# EAGLE design esp32-controller (EAGLE 9.6.2)
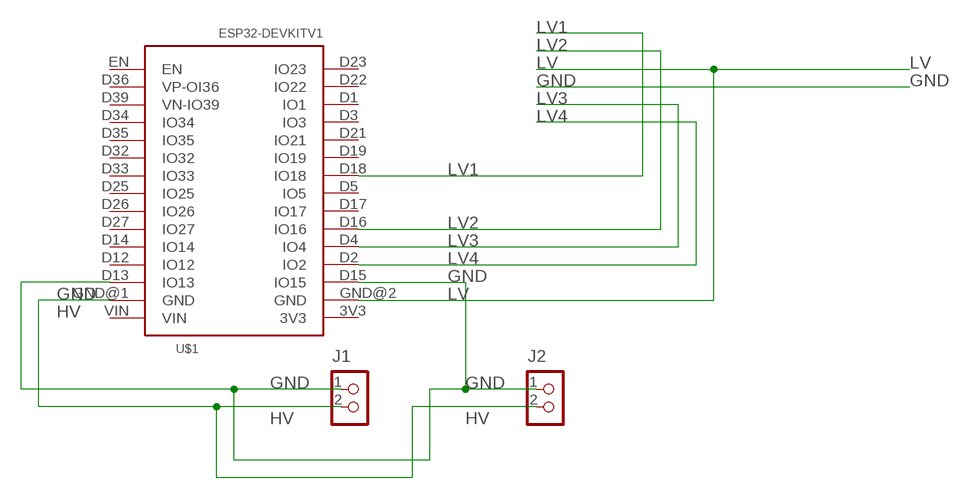
[diagram p0: schematic, sheet 1]

## Parts
J1  CON_TERMINAL_BLOCK_02-5MM  [TERMINAL_BLOCK_2P_5]
J2  CON_TERMINAL_BLOCK_02-5MM  [TERMINAL_BLOCK_2P_5]
U$1  ESP32DEVKITV1  [ESP32-DEVKITV1]

## Nets
GND: J1.1 J2.1 U$1.D13(IO13) U$1.D15(IO15)
HV: J1.2 J2.2 U$1.GND@1(GND)
LV: U$1.GND@2(GND)
LV1: U$1.D18(IO18)
LV2: U$1.D16(IO16)
LV3: U$1.D4(IO4)
LV4: U$1.D2(IO2)
Unconnected: U$1.3V3 U$1.D1(IO1) U$1.D3(IO3) U$1.D5(IO5) U$1.D12(IO12) U$1.D14(IO14) U$1.D17(IO17) U$1.D19(IO19) U$1.D21(IO21) U$1.D22(IO22) U$1.D23(IO23) U$1.D25(IO25) U$1.D26(IO26) U$1.D27(IO27) U$1.D32(IO32) U$1.D33(IO33) U$1.D34(IO34) U$1.D35(IO35) U$1.D36(VP-OI36) U$1.D39(VN-IO39) U$1.EN U$1.VIN

## Library data of the parts
J1 J2 = tblok:CON_TERMINAL_BLOCK_02: 2 poles wire to board terminal block
U$1 = esp32-devkit:ESP32DEVKITV1

## Board
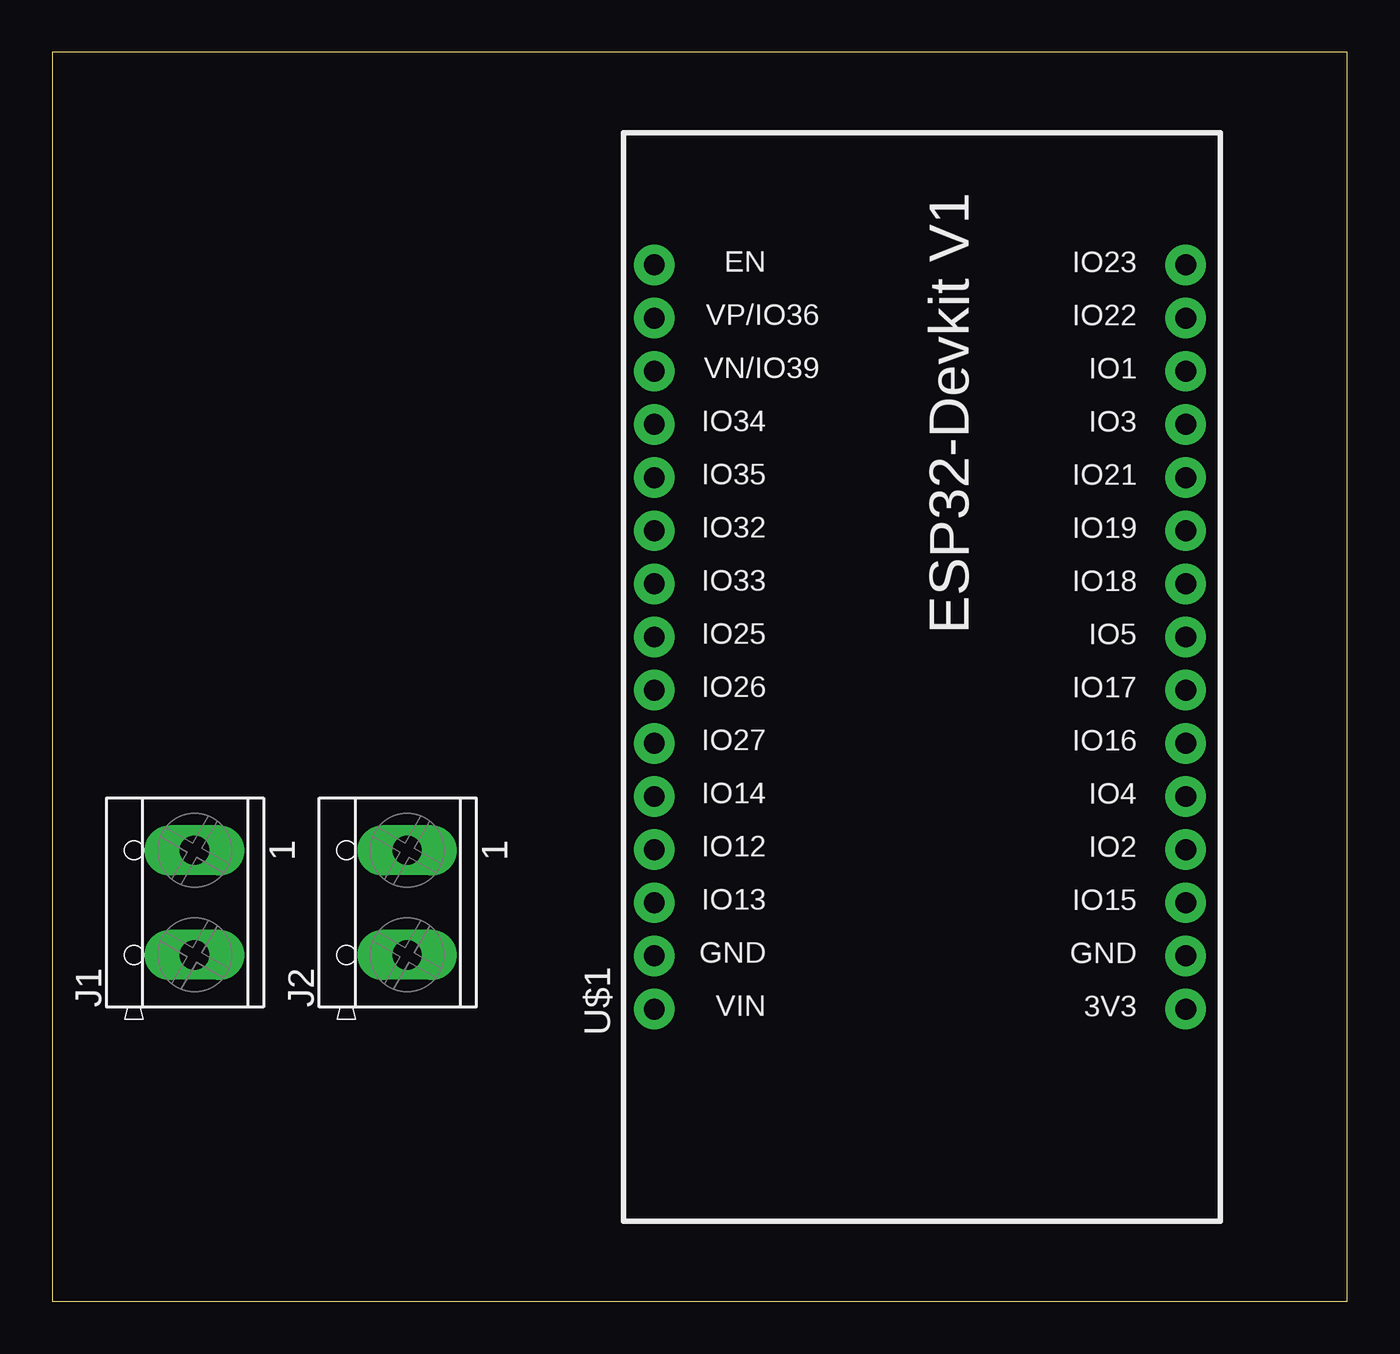
[diagram p1: board, top side]
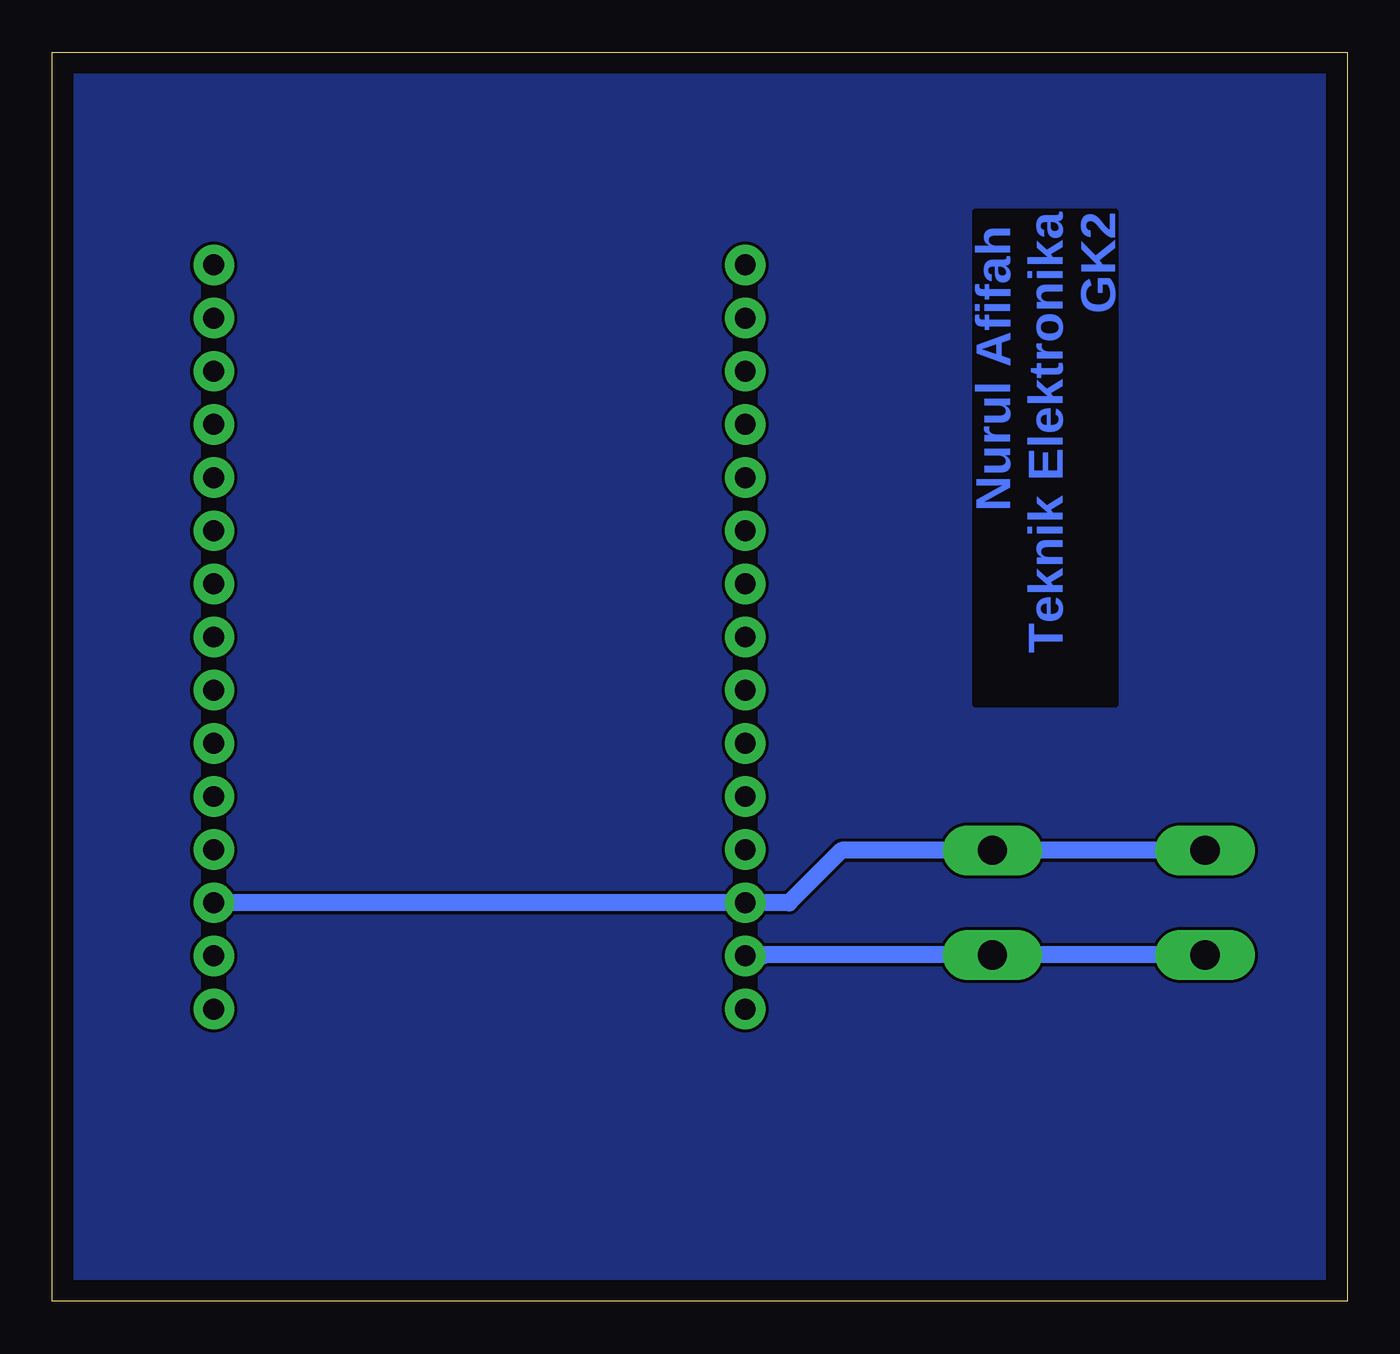
[diagram p2: board, bottom side, seen from below]

Size 61.9 x 59.68 mm. Coordinates in mm from the lower left corner, seen from the top.
Outline: 0,0 61.9,0 61.9,59.68 0,59.68 0,0
Copper layers (1*16): Top 0.035mm / dielectric 1.5mm / Bottom 0.035mm
Design rules "default": minimum track width 6mil, minimum drill 0.35mm, track to track 6mil, track to pad 6mil, pad to pad 6mil, via to via 6mil, smd to smd 6mil, copper to edge 40mil, drill to drill 6mil, minimum pad ring 10mil, minimum via ring 8mil, stop-mask expansion 4mil, vias tented up to drill 0mil, thermal gap 10mil

### Footprints (pad centres in the part's own frame; a part is rotated, then mirrored left to right if it is on the bottom)
TERMINAL_BLOCK_2P_5 = drill 1.4 pad 2.38 long: 1 2.5,-0.45; 2 -2.5,-0.45
ESP32-DEVKITV1 = drill 1 pad 1.93: 3V3 -16.52,-12.27; D1 13.96,-12.27; D2 -8.9,-12.27; D3 11.42,-12.27; D4 -6.36,-12.27; D5 1.26,-12.27; D12 -8.9,13.135; D13 -11.44,13.135; D14 -6.36,13.135; D15 -11.44,-12.27; D16 -3.82,-12.27; D17 -1.28,-12.27; D18 3.8,-12.27; D19 6.34,-12.27; D21 8.88,-12.27; D22 16.5,-12.27; D23 19.04,-12.27; D25 1.26,13.135; D26 -1.28,13.135; D27 -3.82,13.135; D32 6.34,13.135; D33 3.8,13.135; D34 11.42,13.135; D35 8.88,13.135; D36 16.5,13.135; D39 13.96,13.135; EN 19.04,13.135; GND@1 -13.98,13.135; GND@2 -13.98,-12.27; VIN -16.52,13.135

### Placement (x,y rotation side)
J1  6.35,19.05 90 top
J2  16.51,19.05 90 top
U$1  41.91,30.48 90 top

### Tracks (layer width: path | path; a pad name or v marks a point on that pad's centre or on a via)
GND
  Bottom 0.813: J1.1 J2.1 24.17,21.55 26.68,19.04 U$1.D13 U$1.D15
HV
  Bottom 0.813: J1.2 J2.2 27.9,16.55 27.95,16.5 U$1.GND@1
N$1
  pour Bottom: 0,59.69 62.23,59.69 62.23,0 0,0

### Text on the board
Bottom: Nurul Afifah / Teknik Elektronika / GK2